# Altium schematic sheet Block.SchDoc: Title
size A3; Date: Date; CompanyName: Integrated Micro-Electronics Bulgaria; Organization: Design & Development Department; Address1: Drawing Type; Address2: Address 1; Address3: Address 2; Address4: Address 3; DocumentNumber: 730xxx; Revision: 01; SheetNumber: 1; SheetTotal: 1; PageSetup: Record=PageOptions|CenterHorizontal=True|CenterVertical=True|PrintScale=0.70|XCorrection=1.00|YCorrection=1.00|PrintKind=2|BorderSize=5000000|LeftOffset=0|BottomOffset=0|Orientation=2|PaperLength=1000|PaperWidth=1000|Scale=100|PaperSource=7|PrintQuality=-4|MediaType=1|DitherType=10|PaperKind=A4|PrintScaleMode=1; SheetSize: A3; Time: Time; ModifiedDate: Mod. Date
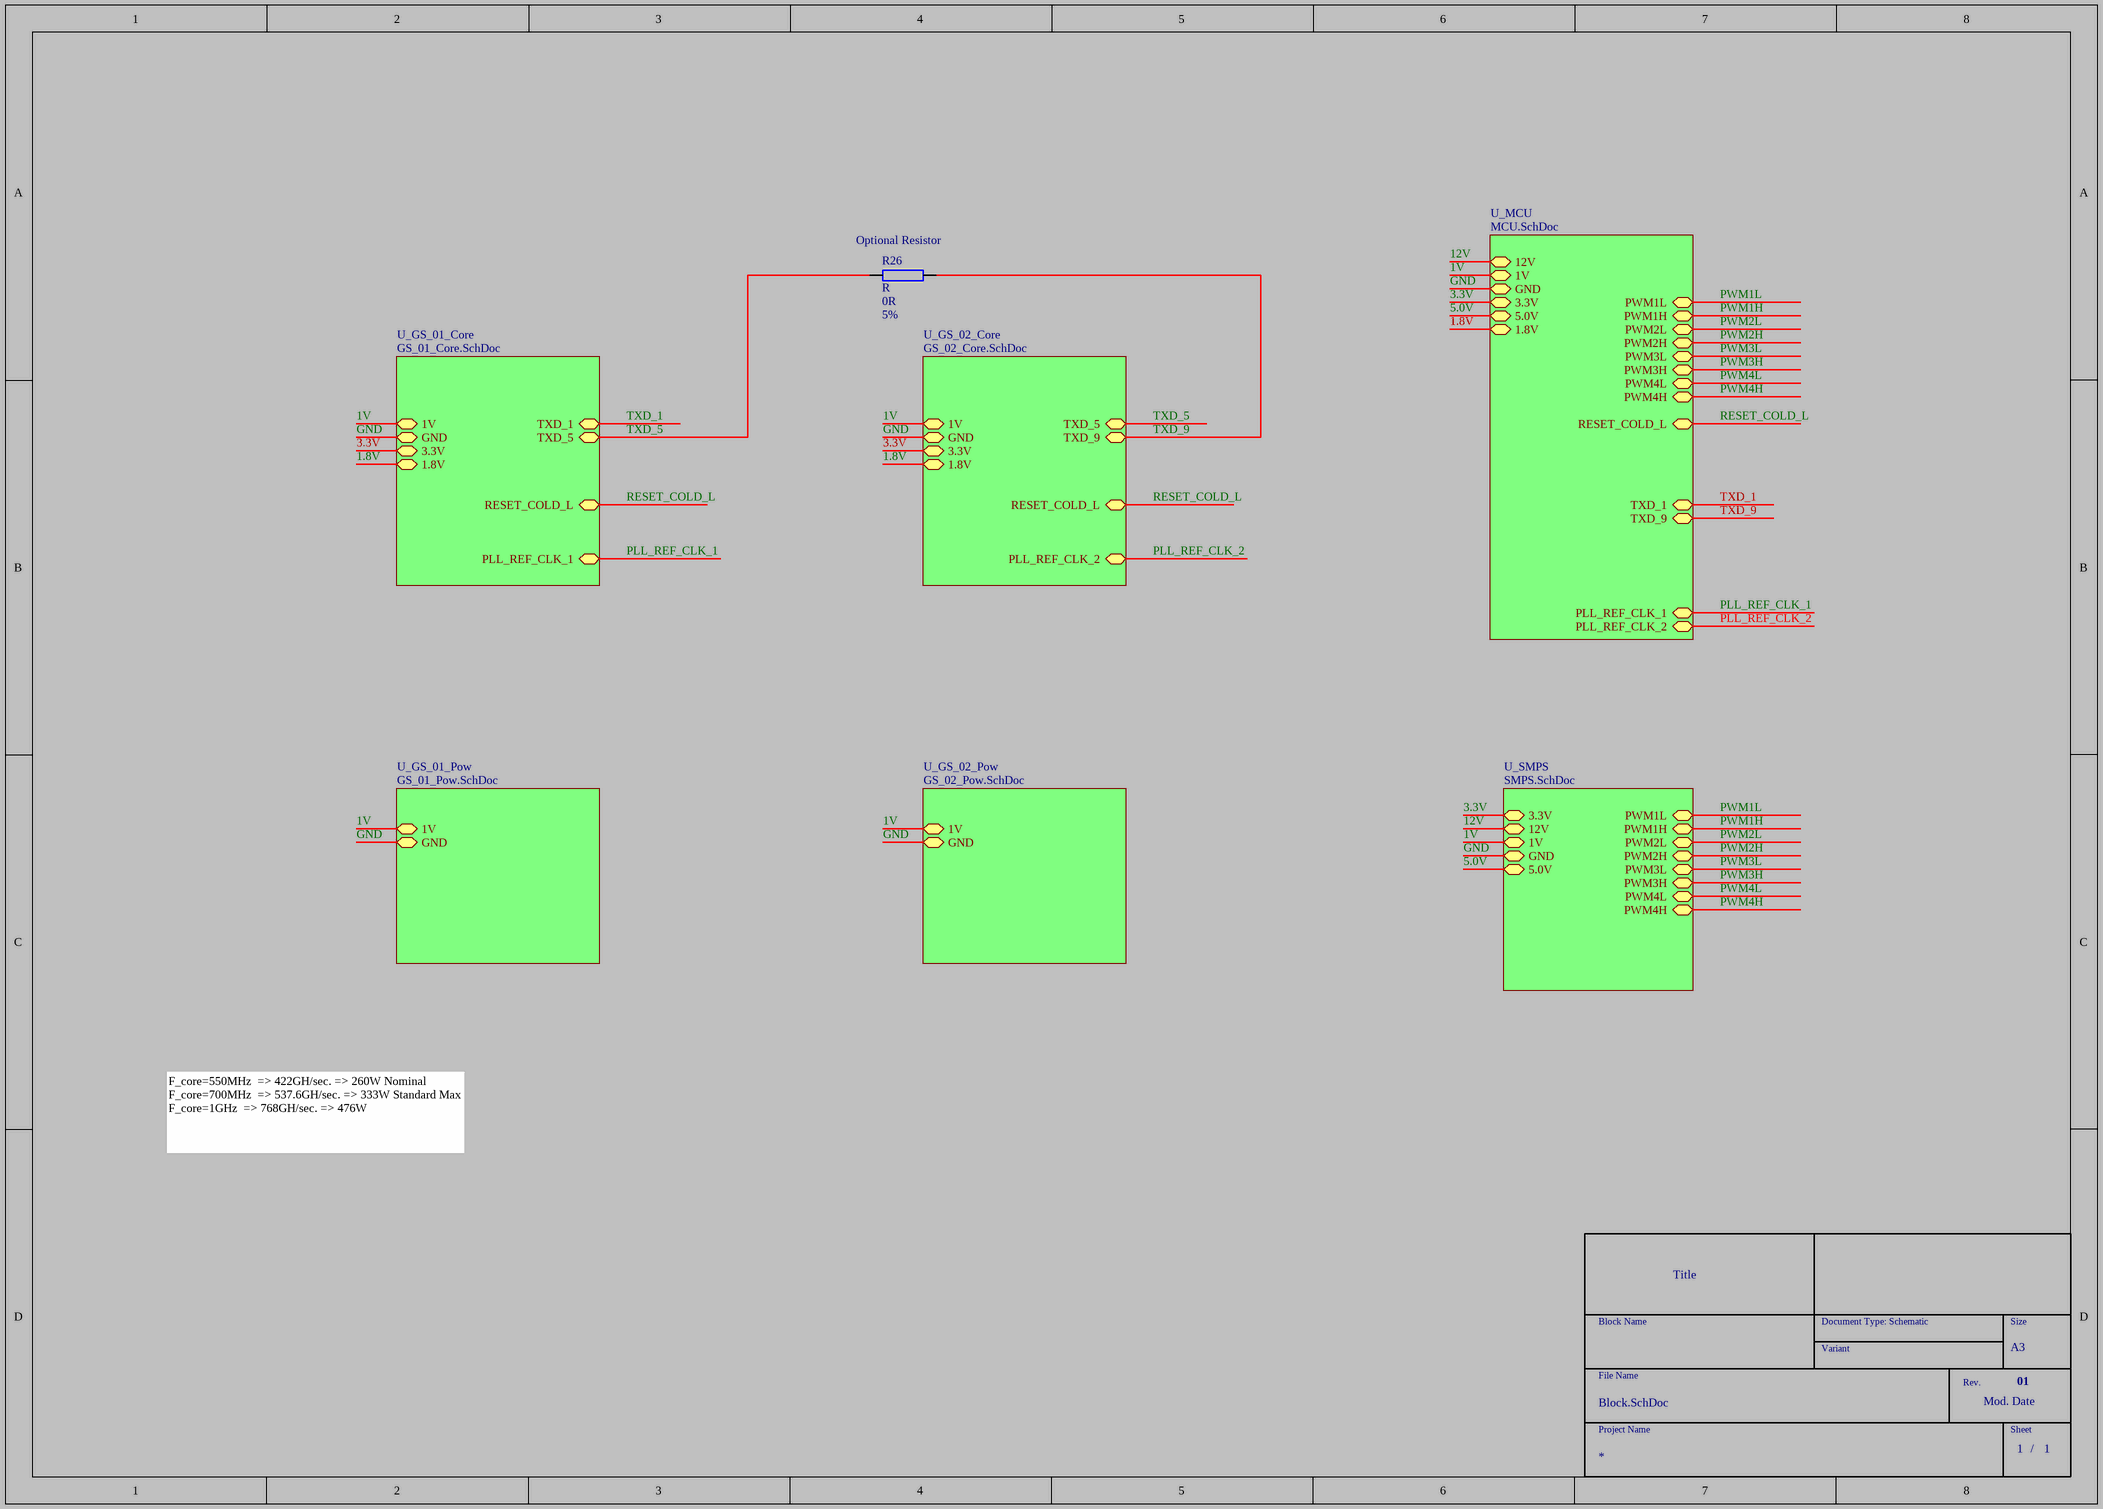
[diagram p0: Block.SchDoc]

## Parts
R26  R  DB_VALUE: 0R  DB_TOLERANCE: 5%  [SMD_0402_RESC1005X37N]

## Sub-sheets
U_GS_01_Core = GS_01_Core.SchDoc: GND, 1V, RESET_COLD_L, PLL_REF_CLK_1, 1.8V, TXD_1, TXD_5, 3.3V
U_GS_01_Pow = GS_01_Pow.SchDoc: 1V, GND
U_GS_02_Core = GS_02_Core.SchDoc: GND, 1V, RESET_COLD_L, PLL_REF_CLK_2, 1.8V, TXD_5, TXD_9, 3.3V
U_GS_02_Pow = GS_02_Pow.SchDoc: 1V, GND
U_MCU = MCU.SchDoc: 1V, GND, 12V, 3.3V, 5.0V, PWM3H, PWM4L, PWM4H, PWM3L, PWM2H, PWM2L, PWM1H, PWM1L, RESET_COLD_L, PLL_REF_CLK_1, PLL_REF_CLK_2, 1.8V, TXD_1, TXD_9
U_SMPS = SMPS.SchDoc: 1V, GND, 12V, 3.3V, 5.0V, PWM3H, PWM4L, PWM4H, PWM3L, PWM2H, PWM2L, PWM1H, PWM1L

## Nets
1.8V: sheet U_GS_02_Core/1.8V, sheet U_MCU/1.8V, sheet U_GS_01_Core/1.8V
1V: sheet U_GS_01_Pow/1V, sheet U_GS_02_Core/1V, sheet U_GS_02_Pow/1V, sheet U_MCU/1V, sheet U_SMPS/1V, sheet U_GS_01_Core/1V
3.3V: sheet U_GS_02_Core/3.3V, sheet U_MCU/3.3V, sheet U_SMPS/3.3V, sheet U_GS_01_Core/3.3V
5.0V: sheet U_MCU/5.0V, sheet U_SMPS/5.0V
12V: sheet U_MCU/12V, sheet U_SMPS/12V
GND: sheet U_GS_01_Pow/GND, sheet U_GS_02_Core/GND, sheet U_GS_02_Pow/GND, sheet U_MCU/GND, sheet U_SMPS/GND, sheet U_GS_01_Core/GND
PLL_REF_CLK_1: sheet U_MCU/PLL_REF_CLK_1, sheet U_GS_01_Core/PLL_REF_CLK_1
PLL_REF_CLK_2: sheet U_GS_02_Core/PLL_REF_CLK_2, sheet U_MCU/PLL_REF_CLK_2
PWM1H: sheet U_MCU/PWM1H, sheet U_SMPS/PWM1H
PWM1L: sheet U_MCU/PWM1L, sheet U_SMPS/PWM1L
PWM2H: sheet U_MCU/PWM2H, sheet U_SMPS/PWM2H
PWM2L: sheet U_MCU/PWM2L, sheet U_SMPS/PWM2L
PWM3H: sheet U_MCU/PWM3H, sheet U_SMPS/PWM3H
PWM3L: sheet U_MCU/PWM3L, sheet U_SMPS/PWM3L
PWM4H: sheet U_MCU/PWM4H, sheet U_SMPS/PWM4H
PWM4L: sheet U_MCU/PWM4L, sheet U_SMPS/PWM4L
RESET_COLD_L: sheet U_GS_02_Core/RESET_COLD_L, sheet U_MCU/RESET_COLD_L, sheet U_GS_01_Core/RESET_COLD_L
TXD_1: sheet U_MCU/TXD_1, sheet U_GS_01_Core/TXD_1
TXD_5: R26.1 ; sheet U_GS_02_Core/TXD_5, sheet U_GS_01_Core/TXD_5
TXD_9: R26.2 ; sheet U_GS_02_Core/TXD_9, sheet U_MCU/TXD_9

## Notes on the sheet
- (near R26) Optional Resistor
- F_core=550MHz  => 422GH/sec. => 260W Nominal
  F_core=700MHz  => 537.6GH/sec. => 333W Standard Max
  F_core=1GHz  => 768GH/sec. => 476W
- Block Name
- Document Type: Schematic
- Size
- File Name
- Variant
- Rev.
- Project Name
- Sheet
- /

## Library data of the parts
R26 = RES000006002: DB_PART_TYPE: SMD; DB_MANUFACTURER_PART: YAGEO    RC0402JR-070R; NOTE: <NOTE>; DB_T_RANGE: -55 to 155; DB_POWER: 1/16W; DB_PACKAGE: 0402; DB_DESCRIPTION: R SMD 0R 5% 1/16W 0402; DB_PRICE: 0.00066; DB_MOQ: 10000; DB_STATUS: NEW; R_BDS: R; DB_PART_NUMBER: RES000006002; DB_PCB_DEVICE: SMD_0402_RESC1005X37N; DB_PRICE_DATE: 2010-12-23; DB_APPROVED_ON: 09.10.2010; DB_DATASHEET: http://john.epiqdesign.com/projects/CIS_Datasheets/PYu-RC0402_51_RoHS_L_6_YAGEO.pdf?rev=138&sc=0